# Altium schematic sheet DAC AMP.SchDoc: DAC Output Amp
size A4; CompanyName: Atrotech.ir; Organization: Atrotech; Address1: L3, 12a Rodborough Rd; Address2: Frenchs Forest; Address3: NSW; Address4: Australia 2086; DocumentNumber: 9; Revision: 1.0; SheetNumber: 9; SheetTotal: 10
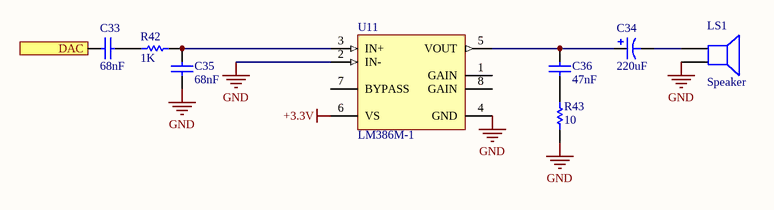
[diagram p0: DAC AMP.SchDoc]

## Parts
C33  68nF  [C603]
C34  220uF  [CAP-TAN-A]
C35  68nF  [C603]
C36  47nF  [C603]
LS1  Speaker  [ph-2]
R42  1K  [R0603]
R43  10  [R0603]
U11  LM386M-1  [SOIC-8N]

## Ports
DAC (in)

## Nets
+3.3V: U11.6(VS)
GND: C35.1 LS1.2 R43.1 U11.2(IN-) U11.4(GND)
DAC: C33.1 ; port DAC
NetC33_2: C33.2 R42.1
NetC34_1: C34.1 C36.2 U11.5(VOUT)
NetC34_2: C34.2 LS1.1
NetC35_2: C35.2 R42.2 U11.3(IN+)
NetC36_1: C36.1 R43.2

Not connected (* = marked no-connect by the designer): U11 1(GAIN) 7(BYPASS) 8(GAIN)

## Notes on the sheet
- Title
- Size:
- Date:
- A4
- Number:
- Time:
- Revision:
- Sheet
- of
- Atrotech co.
- www.atrotech.ir <http://www.atrotech.ir>
- +98 90 369 22 999
- Tehran
- IRAN
- File:

## Library data of the parts
C33 C35 C36 = Cap: Capacitor; Designer: Parsa Malekpour
  C33 C35: Value: 68nF
  C36: Value: 47nF
C34 = CAP-POL: Polar Capacitor; Voltage: 10V; Value: 220uF
LS1 = Speaker: Loudspeaker; Published: 24-Mar-1999; LatestRevisionDate: 17-Jul-2002; LatestRevisionNote: Re-released for DXP Platform.; PackageReference: PIN2; Publisher: Altium Limited
R42 R43 = Resistor: Designer: Parsa Malekpour
  R42: Value: 1K
  R43: Value: 10
U11 = LM386M-1: Low Voltage Audio Power Amplifier, 8-pin Narrow SOIC; Manufacturer: National Semiconductor; PackageTopMarking: NSZXTT*LM386*M-1; PowerWise: N; CompType: Audio IC; High-Reliability: Y; DatasheetVersion: Aug-2000; PackageVersion: revM, May-2009; PackageReference: M08A; PackageDescription: SOIC Narrow, 4.9 x 3.9 x 1.45mm, 8 Lead, 1.27mm Pitch; PartNumber: LM386M-1; RoHS: N; PinCount: 8; Code_JEDEC: MS-012-AA; Code_IPC: SOIC127P600-8; ComponentLink1Description: Manufacturer URL; ComponentLink1URL: http://www.national.com/; ComponentLink2Description: LM386 Datasheet; ComponentLink2URL: http://www.national.com/ds/LM/LM386.pdf; ComponentLink3Description: LM386 Web Page; ComponentLink3URL: http://www.national.com/pf/LM/LM386.html; ComponentLink4Description: M08A Package Page; ComponentLink4URL: http://www.national.com/packaging/folders/m08a.html